# EAGLE design SolarLipoCharger_v02b (EAGLE 5.11)
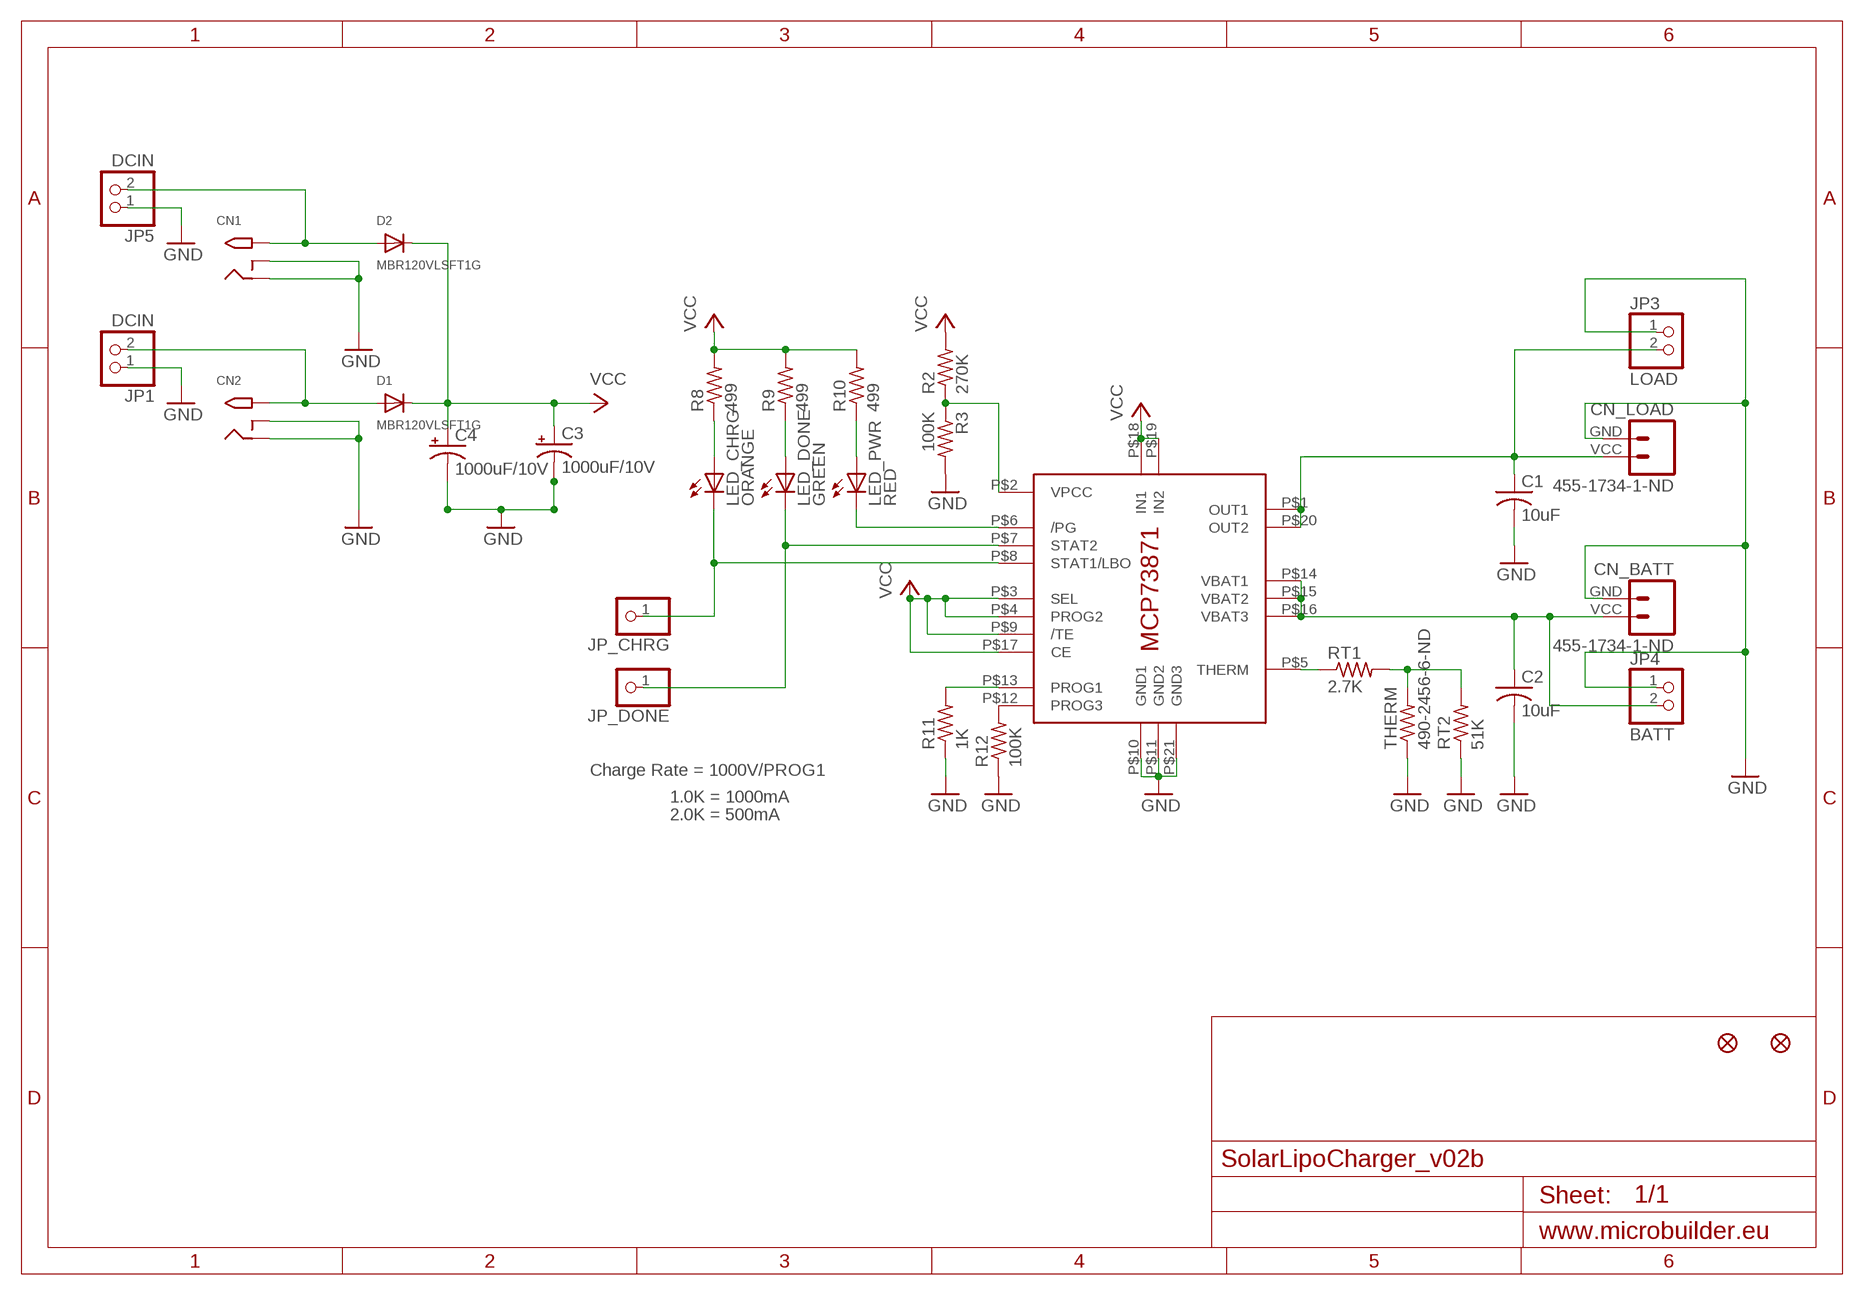
[diagram p0: schematic, sheet 1]

## Parts
C1  10uF  C-USC0805K  [C0805K]
C2  10uF  C-USC0805K  [C0805K]
C3  1000uF/10V  CPOL_FK_G  [C_PANASONIC_FK_G]
C4  1000uF/10V  CPOL_FK_G  [C_PANASONIC_FK_G]
CN1  2.1MMJACKTHM  [PJ-102A]
CN2  2.1MMJACKTHM  [PJ-102A]
CN_BATT  455-1734-1-ND  M02  [JST-2-VERT-SMD]
CN_LOAD  455-1734-1-ND  M02  [JST-2-VERT-SMD]
D1  MBR120VLSFT1G  DIODE  [SOD-123]
D2  MBR120VLSFT1G  DIODE  [SOD-123]
FID1  FIDUCIAL1X2  [FIDUCIAL-1X2]
FID2  FIDUCIAL1X2  [FIDUCIAL-1X2]
IC1  MCP73871  [QFN20_4MM]
JP1  DCIN  HEADER-1X2  [1X02_OVAL]
JP3  LOAD  HEADER-1X2  [1X02_OVAL]
JP4  BATT  HEADER-1X2  [1X02_OVAL]
JP5  DCIN  HEADER-1X2  [1X02_OVAL]
JP_CHRG  HEADER-1X1ROUND  [1X01_ROUND]
JP_DONE  HEADER-1X1ROUND  [1X01_ROUND]
LED_CHRG  ORANGE  LEDCHIP-LED0805  [CHIP-LED0805]
LED_DONE  GREEN  LEDCHIP-LED0805  [CHIP-LED0805]
LED_PWR  RED  LEDCHIP-LED0805  [CHIP-LED0805]
R2  270K  R-US_R0805  [R0805]
R3  100K  R-US_R0805  [R0805]
R8  499  R-US_R0805  [R0805]
R9  499  R-US_R0805  [R0805]
R10  499  R-US_R0805  [R0805]
R11  1K  R-US_R0805  [R0805]
R12  100K  R-US_R0805  [R0805]
RT1  2.7K  R-US_R0805  [R0805]
RT2  51K  R-US_R0805  [R0805]
THERM  490-2456-6-ND  R-US_R0805  [R0805]

## Nets
BATT: C2.1 CN_BATT.VCC IC1.P$14(VBAT1) IC1.P$15(VBAT2) IC1.P$16(VBAT3) JP4.2
GND: C1.2 C2.2 C3.- C4.- CN1.RING CN1.RING_SW CN2.RING CN2.RING_SW CN_BATT.GND CN_LOAD.GND IC1.P$10(GND1) IC1.P$11(GND2) IC1.P$21(GND3) JP1.1 JP3.1 JP4.1 JP5.1 R3.2 R11.1 R12.1 RT2.1 THERM.1
N$1: IC1.P$6(/PG) LED_PWR.C
N$2: CN1.TIP D2.A JP5.2
N$4: IC1.P$7(STAT2) JP_DONE.1 LED_DONE.C
N$5: IC1.P$5(THERM) RT1.1
N$6: IC1.P$2(VPCC) R2.1 R3.1
N$7: C1.1 CN_LOAD.VCC IC1.P$1(OUT1) IC1.P$20(OUT2) JP3.2
N$8: RT1.2 RT2.2 THERM.2
N$10: CN2.TIP D1.A JP1.2
N$11: IC1.P$8(STAT1/LBO) JP_CHRG.1 LED_CHRG.C
N$12: LED_CHRG.A R8.1
N$13: LED_DONE.A R9.1
N$14: LED_PWR.A R10.1
N$15: IC1.P$12(PROG3) R12.2
N$16: IC1.P$13(PROG1) R11.2
VCC: C3.+ C4.+ D1.C D2.C IC1.P$3(SEL) IC1.P$4(PROG2) IC1.P$9(/TE) IC1.P$17(CE) IC1.P$18(IN1) IC1.P$19(IN2) R2.2 R8.2 R9.2 R10.2

## Notes on the sheet
- Charge Rate = 1000V/PROG1
- 1.0K = 1000mA
- 2.0K = 500mA

## Library data of the parts
C1 C2 = adafruit:C-US: CAPACITOR, American symbol
C3 C4 = bootstrapsolar:CPOL_FK_G: Capacitor. Panasonic FK series. 10uF FK in G dimensions is DigiKey part #PCE3990TR-ND
CN1 CN2 = adafruit-bss:2.1MMJACK: 2.1mm x 5.5mm THM DC jack with internal switch. Digikey part #PJ-102A, 4UCON part #05537 2.1mm x 5.5mm SMT DC jack with internal switch. Digikey part #PJ-002A-SMT, 4UCON part #03267 By microbuilder.eu & adafruit.com
CN_BATT CN_LOAD = bootstrapsolar:M02: Two pin connector. JST-2-VERT is DigiKey part number 455-1734-1-ND
D1 D2 = bootstrapsolar:DIODE
FID1 FID2 = SparkFun:FIDUCIAL: Fiducial Alignment Points Various fiducial points for machine vision alignment.
IC1 = adafruit:MCP73871
JP1 JP3-JP5 = microbuilder:HEADER-1X2: PIN HEADER
JP_CHRG JP_DONE = microbuilder:HEADER-1X1: PIN HEADER
LED_CHRG LED_DONE LED_PWR = adafruit-bss:LED: LED OSRAM: - CHIPLED LG R971, LG N971, LY N971, LG Q971, LY Q971, LO R971, LY R971 LH N974, LH R974 LS Q976, LO Q976, LY Q976 LO Q996 - Hyper CHIPLED LW Q18S LB Q993, LB Q99A, LB R99A - SideLED LS A670, LO A670, LY A670, LG A670, LP A670 LB A673, LV A673, LT A673, LW A673 LH A674 LY A675 LS A676, LA A676, LO A676, LY A676, LW A676 LS A679, LY A679, LG A679 - Hyper Micro SIDELED® LS Y876, LA Y876, LO Y876, LY Y876 LT Y87S - SmartLED LW L88C, LW L88S LB L89C, LB L89S, LG L890 LS L89K, LO L89K, LY L89K LS L896, LA L896, LO L896, LY L896 - TOPLED LS T670, LO T670, LY T670, LG T670, LP T670 LSG T670, LSP T670, LSY T670, LOP T670, LYG T670 LG T671, LOG T671, LSG T671 LB T673, LV T673, LT T673, LW T673 LH T674 LS T676, LA T676, LO T676, LY T676, LB T676, LH T676, LSB T676, LW T676 LB T67C, LV T67C, LT T67C, LS T67K, LO T67K, LY T67K, LW E67C LS E67B, LA E67B, LO E67B, LY E67B, LB E67C, LV E67C, LT E67C LW T67C LS T679, LY T679, LG T679 LS T770, LO T770, LY T770, LG T770, LP T770 LB T773, LV T773, LT T773, LW T773 LH T774 LS E675, LA E675, LY E675, LS T675 LS T776, LA T776, LO T776, LY T776, LB T776 LHGB T686 LT T68C, LB T68C - Hyper Mini TOPLED® LB M676 - Mini TOPLED Santana® LG M470 LS M47K, LO M47K, LY M47K Source: http://www.osram.convergy.de/
R2 R3 R8-R12 RT1 RT2 THERM = adafruit-bss:R-US_: RESISTOR, American symbol

## Board
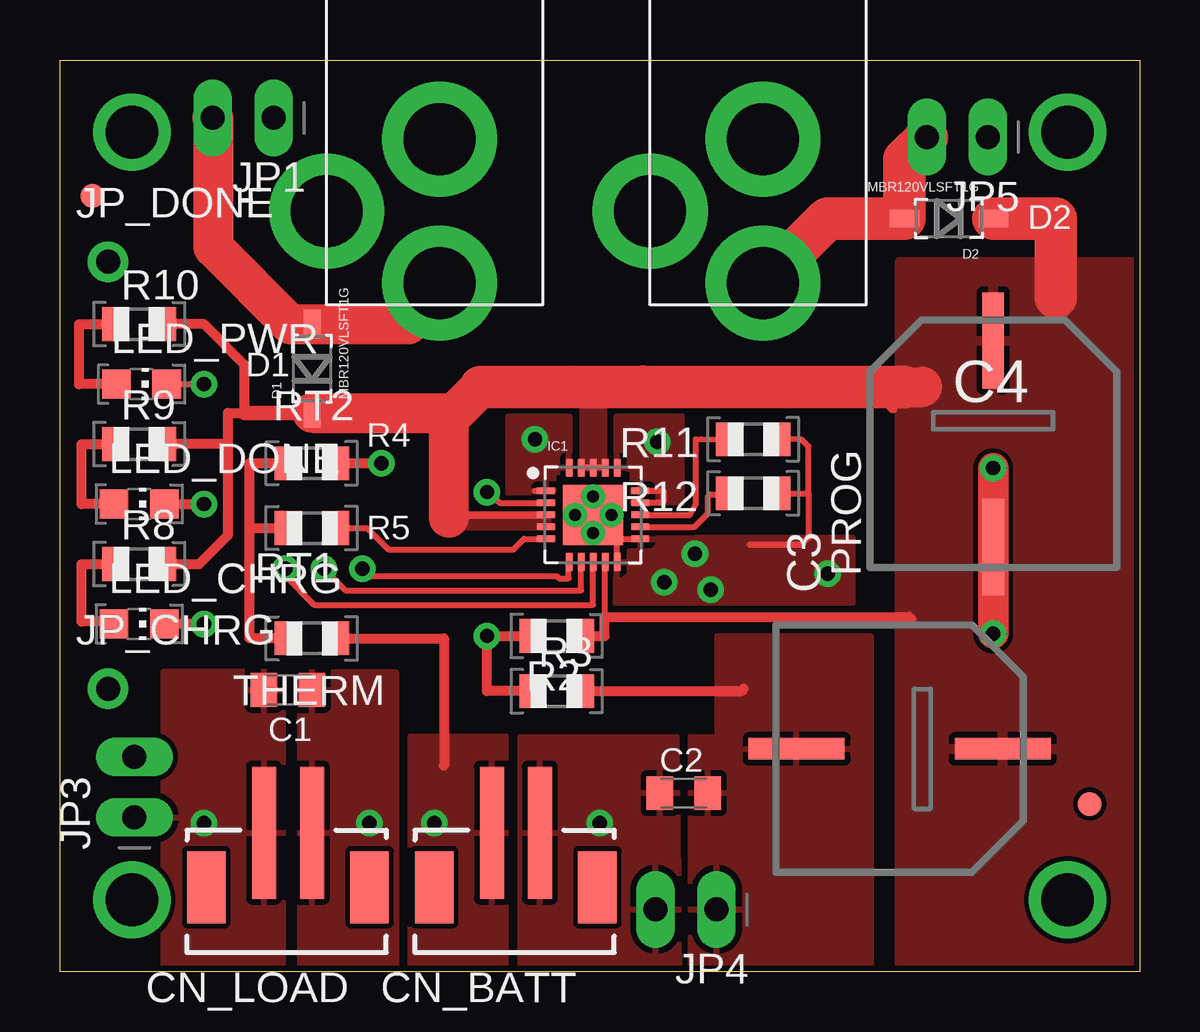
[diagram p1: board, top side]
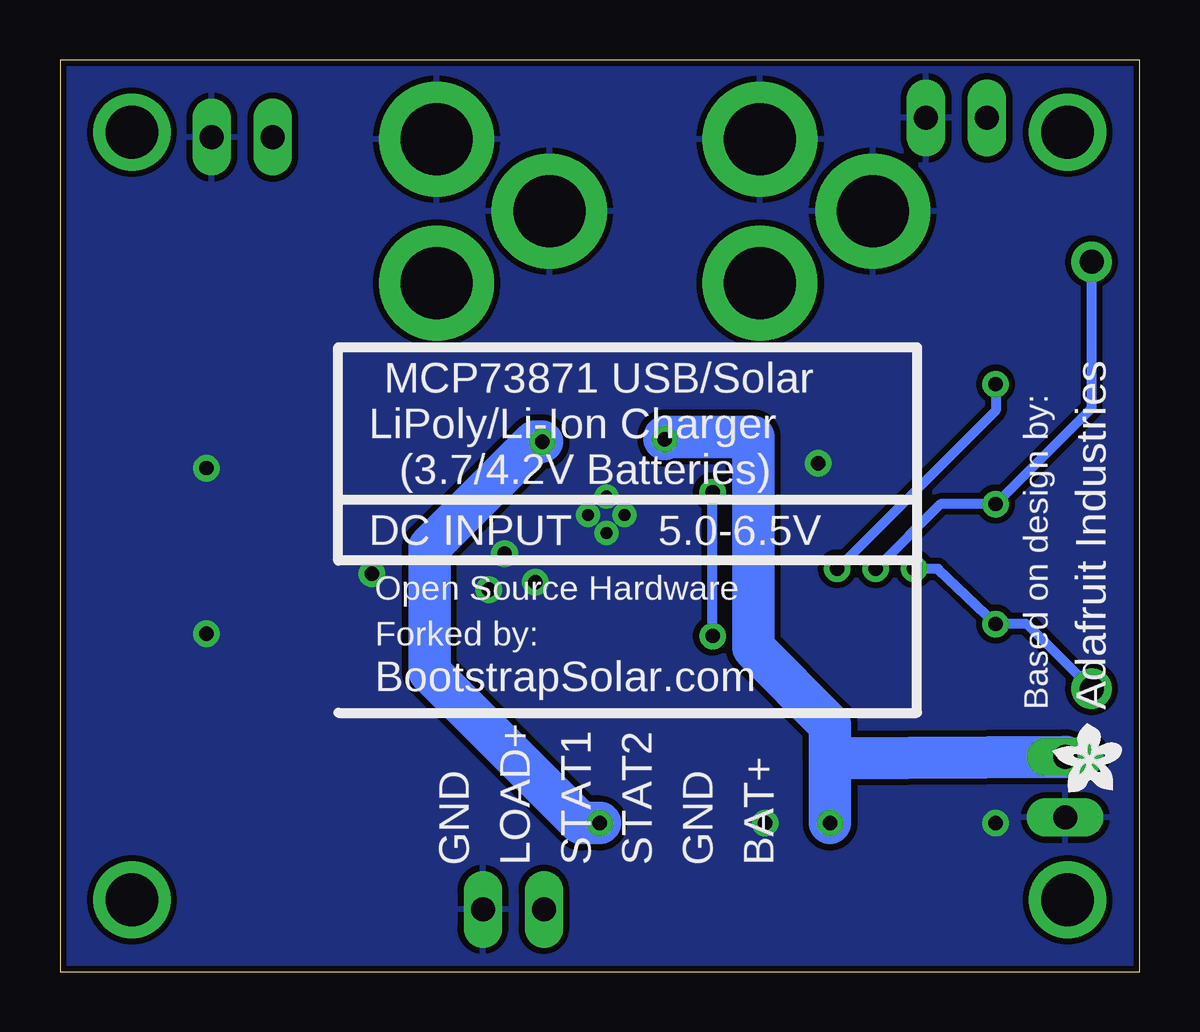
[diagram p2: board, bottom side, seen from below]

Size 45 x 38 mm. Coordinates in mm from the lower left corner, seen from the top.
Outline: 0,0 0,38 45,38 45,0 0,0
Copper layers (1*16): Top 0.035mm / dielectric 1.5mm / Bottom 0.035mm
Design rules "SparkFun": minimum track width 8mil, minimum drill 20mil, track to track 8mil, track to pad 8mil, pad to pad 8mil, via to via 8mil, smd to smd 8mil, copper to edge 10mil, drill to drill 8mil, minimum pad ring 12mil, minimum via ring 10mil, stop-mask expansion 4mil, vias tented up to drill 25mil, thermal gap 10mil
tRestrict: 1 lines

### Footprints (pad centres in the part's own frame; a part is rotated, then mirrored left to right if it is on the bottom)
C0805K = smd 1.1 x 1.4: 1 -1,0; 2 1,0
C_PANASONIC_FK_G = smd 0.9 x 4: + 0,-4.3; - 0,4.3
PJ-102A = drill 3 pad 4.8 round: RING 0.1,-3.29; RING_SW -4.6,-6.29; TIP 0.1,-9.29
JST-2-VERT-SMD = smd 1 x 5.5: GND 1,-2; VCC -1,-2 | smd 1.6 x 3: P$1 -3.4,0.27; P$2 3.4,0.27
SOD-123 = smd 1.2 x 0.7: A 1.85,0; C -1.85,0
FIDUCIAL-1X2 = smd 1 x 1: 1 0,0
QFN20_4MM = smd 0.73 x 0.28: P$1 -1.965,1; P$2 -1.965,0.5; P$3 -1.965,0; P$4 -1.965,-0.5; P$5 -1.965,-1; P$11 1.965,-1; P$12 1.965,-0.5; P$13 1.965,0; P$14 1.965,0.5; P$15 1.965,1 | smd 0.28 x 0.73: P$6 -1,-1.965; P$7 -0.5,-1.965; P$8 0,-1.965; P$9 0.5,-1.965; P$10 1,-1.965; P$16 1,1.965; P$17 0.5,1.965; P$18 0,1.965; P$19 -0.5,1.965; P$20 -1,1.965 | smd 2.5 x 2.5: P$21 0,0
1X02_OVAL = drill 1 long: 1 -1.27,0; 2 1.27,0
1X01_ROUND = drill 1 pad 1.676 round: 1 0,0
CHIP-LED0805 = smd 1.2 x 1.2: A 0,-1.05; C 0,1.05
R0805 = smd 1.1 x 1.4: 1 -1,0; 2 1,0

### Placement (x,y rotation side)
C1  9.5,11.75 180 top
C2  26,7.45 0 top
C3  35,9.3 90 top
C4  38.9,22.02 180 top
CN1  29.2,38 0 top
CN2  15.72,38 0 top
CN_BATT  19,3.8 180 top
CN_LOAD  9.5,3.8 180 top
D1  10.51,25.15 90 top
D2  37.05,31.4 180 top
FID1  42.93,7 0 top
FID2  1.36,32.35 0 top
IC1  22.23,19.05 0 top
JP1  7.63,35.6 180 top
JP3  3.1,7.7 90 top
JP4  26.1,2.6 180 top
JP5  37.4,34.8 180 top
JP_CHRG  2,11.8 0 top
JP_DONE  2,29.6 0 top
LED_CHRG  3.3,14.5 270 top
LED_DONE  3.3,19.5 270 top
LED_PWR  3.4,24.5 270 top
R2  20.7,14 0 top
R3  20.7,11.7 0 top
R8  3.3,17 0 top
R9  3.3,22 0 top
R10  3.3,27 0 top
R11  28.9,22.2 180 top
R12  28.9,19.95 180 top
RT1  10.5,18.5 180 top
RT2  10.5,21.2 180 top
THERM  10.5,13.9 180 top
U$1  [ADAFRUIT200MIL]  2.29,8.89 0 bottom

### Tracks (layer width: path | path; a pad name or v marks a point on that pad's centre or on a via)
BATT  (via drill 0.6)
  Top 0.254: IC1.P$14 25.14,19.55 25.15,19.56 25.15,20.07 24.21,20.07 IC1.P$15
  Bottom 1.778: v24.9,22.1 25.2,22.1 29.6,17.7 29.6,12.5 23.3,6.2 v22.5,6.2
  pour Top: 23.2,20.95 23.2,23.17 25.91,23.17 25.91,19.56 23.88,19.56 23.88,20.95
  pour Top: 19.2,9.8 25.7,9.8 25.8,-0.2 19.2,-0.2
GND  (via drill 0.5, 0.6)
  Top 0.254: v22.23,19.81 23.23,18.05 IC1.P$11 | IC1.P$10 23.23,18.02 23.24,18.03 | R11.1 30.9,22.2 31.2,21.9 31.2,19.95 | 28.75,17.8 30.9,17.8 31.2,18.1 31.2,19.95 | R12.1 31.2,19.95
  Top 0.406: IC1.P$21 v22.99,19.05 | RT2.1 v13.4,21.2 | R3.2 28.4,11.7 28.5,11.8 | THERM.1 16,13.9 16,8.6
  Top 1.27: v38.9,21 C4.- v38.9,14.1
  other vias: 27.13,15.92 25.18,16.24 26.47,17.43 22.23,18.29 21.46,19.05 6,6.2 32,16.6 15.6,6.2
  pour Bottom (isolate 0.254): 0,0 0,38 45,38 45,0
  pour Top: 23.17,18.1 33.04,18.1 33.04,15.37 23.17,15.37
  pour Top: 4.3,12.5 4.3,0.1 9.3,0.1 9.3,12.5
  pour Top: 26.3,9.8 33.8,9.9 33.8,0.2 26.3,0.1
  pour Top: 27.4,14 33.8,14 33.8,4.6 27.4,4.5
  pour Top: 18.6,9.8 14.6,9.8 14.6,-0.4 18.6,-0.4
N$1  (via drill 0.6)
  Top 0.254: LED_PWR.C v6,24.5 | 12.7,16.9 v12.6,16.8 12.9,16.5 20.7,16.5 20.8,16.4 21.2,16.4 21.2,17.06 IC1.P$6
  Bottom 0.406: v12.6,16.8 6,23.4 v6,24.5
N$2
  Top 1.778: CN1.TIP 31.99,31.4 D2.A 35.2,33.87 JP5.2
N$3  (via drill 2.2)
  other vias: 3,35
N$4  (via drill 0.6)
  Top 0.254: 11,16.6 v11,16.8 11.9,15.9 21.73,15.9 IC1.P$7
  Top 0.406: LED_DONE.C v6,19.5
  Bottom 0.406: v11,16.8 8.3,19.5 v6,19.5 2,23.5 JP_DONE.1
N$5
  Top 0.254: IC1.P$5 19.35,18.05 18.9,17.6 13.7,17.6 12.8,18.5 RT1.1
N$6  (via drill 0.6)
  Top 0.254: v17.8,20 18.35,19.55 IC1.P$2
  Top 0.406: R2.1 v17.8,14 17.8,11.7 R3.1
  Bottom 0.406: v17.8,14 v17.8,20
N$7  (via drill 0.6)
  Top 0.254: IC1.P$1 19.8,20.05
  Bottom 1.778: v19.8,22.2 19.8,22.3 16.1,22.3 16.1,13.5 12.9,10.3 12.9,8.9 | JP3.2 12.9,8.9 | 12.9,8.9 v12.9,6.2
  pour Top: 21.25,20.83 21.25,23.13 18.67,23.13 18.67,19.97 20.45,19.97 20.57,20.07 20.57,20.83
  pour Top: 14,12.5 14,0.1 10,0.1 10,12.5
N$8
  Top 0.406: 7.9,18.5 RT1.2 | THERM.2 7.9,13.9 7.9,18.5 | 7.9,18.5 7.9,21.2 RT2.2
N$9  (via drill 2.2)
  other vias: 42,35
N$10
  Top 1.676: CN2.TIP 14.51,27 D1.A 9.6,27 6.4,30.2 6.4,35.56 JP1.2
N$11  (via drill 0.6)
  Top 0.254: IC1.P$8 22.23,15.3 10.6,15.3 9.4,16.5 v9.4,16.8
  Top 0.406: v6,14.5 LED_CHRG.C
  Bottom 0.406: v9.4,16.8 8.4,16.8 v6,14.5 4.7,14.5 JP_CHRG.1
N$12
  Top 0.406: R8.1 0.9,17 0.9,14.6 2.25,14.6 LED_CHRG.A
N$13
  Top 0.406: R9.1 0.9,22 0.9,19.5 LED_DONE.A
N$14
  Top 0.406: R10.1 0.8,27 0.8,24.5 LED_PWR.A
N$15
  Top 0.254: IC1.P$12 26.45,18.55 27,19.1 27,19.8 27.1,19.9 27.85,19.9 R12.2
N$16
  Top 0.254: IC1.P$13 26.25,19.05 26.5,19.5 26.5,22.2 | 26.5,22.2 26.7,22.2 | 26.5,22.2 R11.2
N$17  (via drill 2.2)
  other vias: 42,3
N$18  (via drill 2.2)
  other vias: 3,3
VCC
  Top 0.254: IC1.P$9 22.73,14.82 22.7,14.8 | IC1.P$17 IC1.P$18 IC1.P$19
  Top 0.305: 21.84,24.38 21.73,24.27 | IC1.P$3 16.64,19.05 16.2,18.92
  Top 0.406: R8.2 5.8,17 7,18.2 7,22 | R10.2 6,27 7.7,25.3 7.7,23.3 | 33.2,25 34.7,23.5 34.7,24.18 34.9,24.38 | R2.2 22.7,14 22.7,14.8 35.4,14.8 35.5,14.7 | 33.7,24.38 33.9,24.18 | 7,22 7,23.3 7.7,23.3 | 7,22 R9.2 | 7.7,23.3
  Top 0.61: 7.7,23.3 D1.C
  Top 1.676: 35.2,24.38 35.94,24.38 | D1.C 16.2,23.3 | 17.53,24.38 16.44,23.3 16.2,23.3 | 24.38,24.38 24.31,24.46 | 16.2,23.3 | 22.23,24.38 21.15,24.44 | 16.2,23.3 16.2,18.92
  Top 1.778: 17.53,24.38 21.84,24.38 22.23,24.38 24.38,24.38 33.7,24.38 34.9,24.38 35.2,24.38 | D2.C 41.5,31.4 41.5,28.1
  pour Top (no thermals): 20.32,19.05 16.26,19.05 16.26,18.54 20.32,18.54
  pour Top: 35,29.6 45.1,29.6 44.8,0.3 35,0.3
  pour Top (no thermals): 21.75,21 22.7,21 22.7,25.1 21.75,25.1

### Text on the board
tPlace: - | R4 | R5 | PROG
bPlace: MCP73871 USB/Solar | LiPoly/Li-Ion Charger | (3.7/4.2V Batteries) | 5.0-6.5V | DC INPUT | Open Source Hardware | Forked by: | BootstrapSolar.com | Adafruit Industries | Based on design by: | BAT+ | GND | STAT2 | STAT1 | LOAD+ | GND
tNames: D2 | D1
tDocu: + | + | 6V MAX | BootstrapSolar.com | - | LOAD | + | - | BATT | + | + | v0.2 Rev B
bDocu: BootstrapSolar | Solar Lipo Charger | DC Input: 6V 1.8A Max | DC Output: 3-6V Variable | v0.2 Rev B | Adafruit Industries | Based on design by | Open Source Hardware | See http://bootstrapsolar.com